# Altium schematic sheet MPU6000.SchDoc
size A4
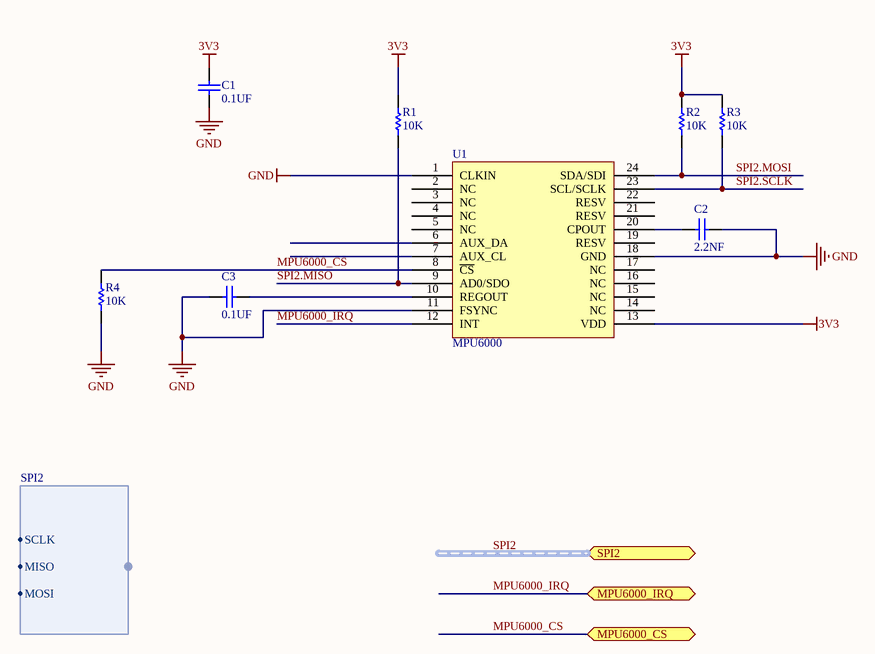
[diagram p0: MPU6000.SchDoc]

## Parts
C1  value 0.1UF  [RC0805]  (hidden comment: Cap)
C2  value 2.2NF  [RC0805]  (hidden comment: Cap)
C3  value 0.1UF  [RC0805]  (hidden comment: Cap)
R1  value 10K  [RC0805]  (hidden comment: Res1)
R2  value 10K  [RC0805]  (hidden comment: Res1)
R3  value 10K  [RC0805]  (hidden comment: Res1)
R4  value 10K  [RC0805]  (hidden comment: Res1)
U1  MPU6000  [QFN24_M]

## Ports
MPU6000_CS, MPU6000_IRQ, SPI2 (harness SPI2)

## Harnesses
SPI2: SCLK, MISO, MOSI

## Nets
3V3: C1.2 R1.1 R2.1 R3.1 U1.13(VDD)
GND: C1.1 C2.2 C3.1 R4.2 U1.1(CLKIN) U1.11(FSYNC) U1.18(GND)
MPU6000_CS: R4.1 U1.8(~{CS}) ; port MPU6000_CS
MPU6000_IRQ: U1.12(INT) ; port MPU6000_IRQ
SPI2.MISO: R1.2 U1.9(AD0/SDO)
SPI2.MOSI: R2.2 U1.24(SDA/SDI)
SPI2.SCLK: R3.2 U1.23(SCL/SCLK)
NetC2_1: C2.1 U1.20(CPOUT)
NetC3_2: C3.2 U1.10(REGOUT)

Not connected (* = marked no-connect by the designer): U1 2(NC) 3(NC) 4(NC) 5(NC) 6(AUX_DA) 7(AUX_CL) 14(NC) 15(NC) 16(NC) 17(NC) 19(RESV) 21(RESV) 22(RESV)

## Buses and harness runs
harness SPI2 = port SPI2

## Library data of the parts
C1-C3 = Cap: Capacitor; Published: 8-Jun-2000; LatestRevisionDate: 17-Jul-2002; LatestRevisionNote: Re-released for DXP Platform.; PackageReference: RAD-0.3; Publisher: Altium Limited; PackageDescription: Radial Cap, Thru-Hole; 2 Leads; 0.3 in Pin Spacing
R1-R4 = Res1: Resistor; Published: 8-Jun-2000; LatestRevisionDate: 17-Jul-2002; LatestRevisionNote: Re-released for DXP Platform.; PackageReference: AXIAL-0.3; Publisher: Altium Limited; PackageDescription: Axial Device, Thru-Hole; 2 Leads; 0.3 in Pin Spacing